# Altium schematic sheet Sheet2.SchDoc
size A
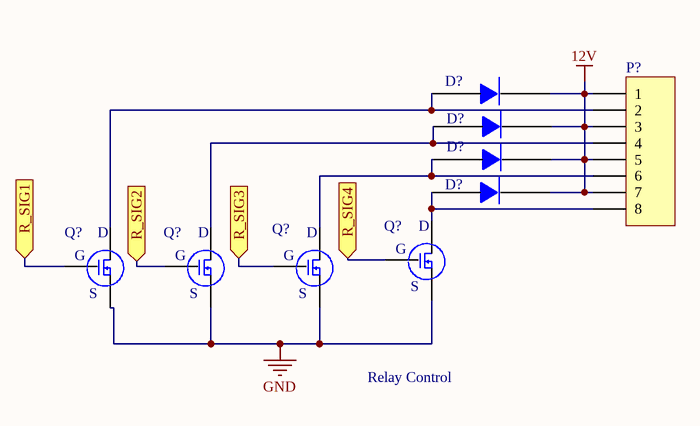
[diagram p0: Sheet2.SchDoc]

## Parts
(Parts that share a designator on the sheet are numbered #1, #2 ... from top to bottom, then left to right.)
D?#1  *  [SOT95P245X110-3N]  (value not drawn)
D?#2  *  [SOT95P245X110-3N]  (value not drawn)
D?#3  *  [SOT95P245X110-3N]  (value not drawn)
D?#4  *  [SOT95P245X110-3N]  (value not drawn)
P?  (no value)  [HDR1X8]
Q?#1  N-FET  [SOT95P245X110-3N]  (value not drawn)
Q?#2  N-FET  [SOT95P245X110-3N]  (value not drawn)
Q?#3  N-FET  [SOT95P245X110-3N]  (value not drawn)
Q?#4  N-FET  [SOT95P245X110-3N]  (value not drawn)

## Ports
R_SIG1 (in), R_SIG2 (in), R_SIG3 (in), R_SIG4 (in)

## Nets
12V: D?#1.3 D?#2.3 D?#3.3 D?#4.3 P?.1 P?.3 P?.5 P?.7
GND: Q?#1.2 Q?#2.2 Q?#3.2 Q?#4.2
R_SIG1: Q?#2.1(G) ; port R_SIG1
R_SIG2: Q?#3.1(G) ; port R_SIG2
R_SIG3: Q?#4.1(G) ; port R_SIG3
R_SIG4: Q?#1.1(G) ; port R_SIG4
NetD?#1_1: D?#1.1 P?.2 Q?#2.3
NetD?#2_1: D?#2.1 P?.4 Q?#3.3
NetD?#3_1: D?#3.1 P?.6 Q?#4.3
NetD?#4_1: D?#4.1 P?.8 Q?#1.3

## Notes on the sheet
- Relay Control
- (in symbol MOSFET-N) D; S

## Library data of the parts
D?#1-D?#4 = Diode-General: Product #: MMBD914L
P? = Header 8: Header, 8-Pin; LatestRevisionDate: 17-Jul-2002; LatestRevisionNote: Re-released for DXP Platform.; Publisher: Altium Limited
Q?#1-Q?#4 = MOSFET-N: Product #: BSN20